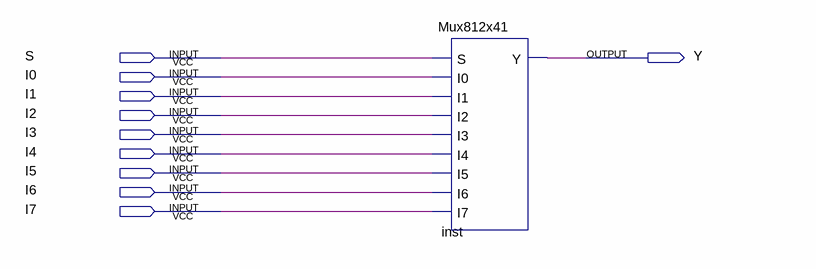
[diagram p0: schematic sheet]
// Quartus schematic BlocoMux812x41.bdf as structural Verilog: 1 symbols, 10 pins
module BlocoMux812x41 (
  input  S,
  input  I0,
  input  I1,
  input  I2,
  input  I3,
  input  I4,
  input  I5,
  input  I6,
  input  I7,
  output Y
);

  Mux812x41 inst (.S(S), .I0(I0), .I1(I1), .I2(I2), .I3(I3), .I4(I4), .I5(I5), .I6(I6), .I7(I7), .Y(Y));
endmodule
